# EAGLE schematic Self Designed Schematic (EAGLE 9.4.2)
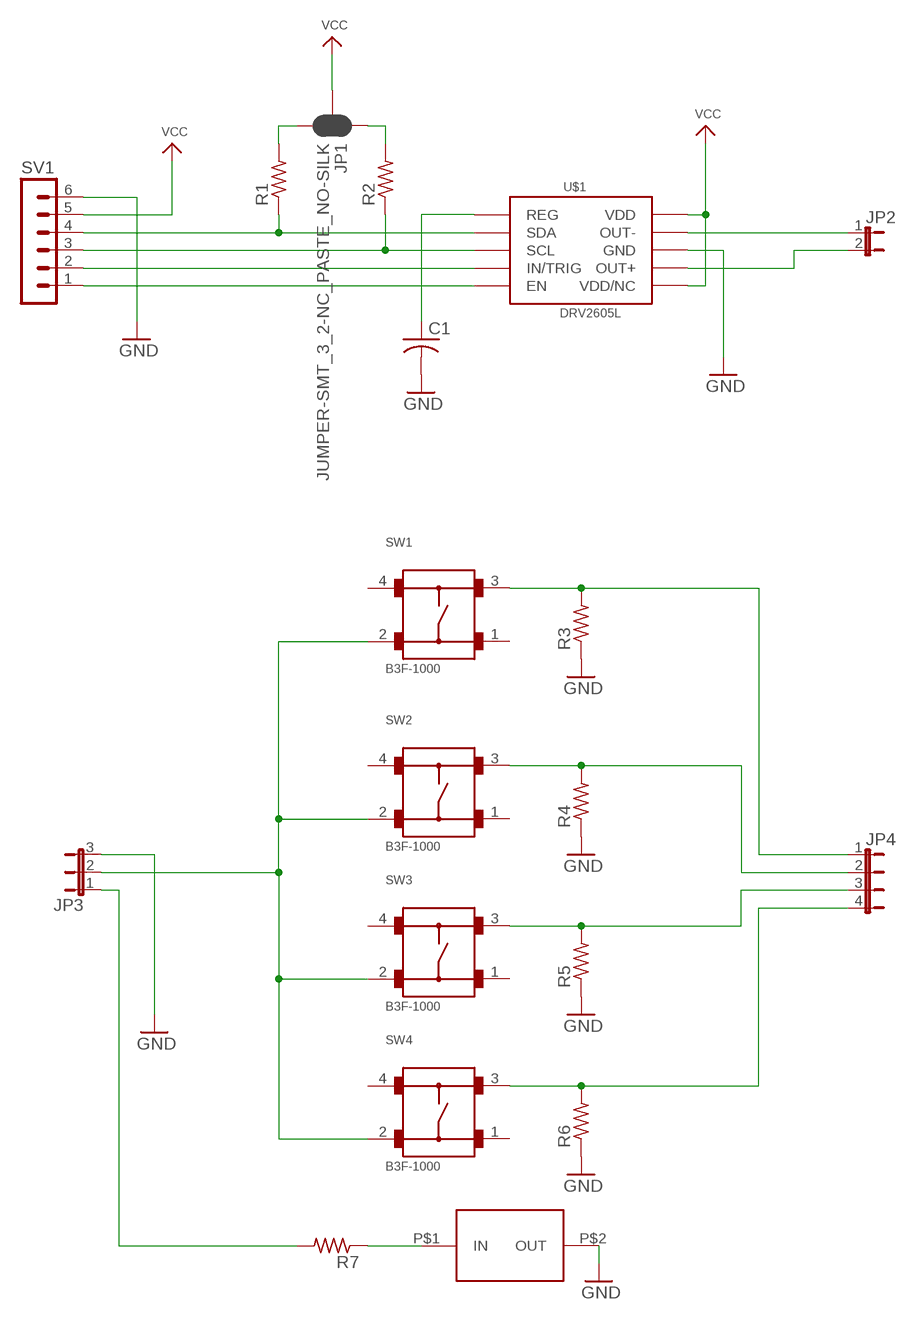
[diagram p0: schematic, sheet 1]

## Parts
C1  C-USC0402  [C0402]
JP1  JUMPER-SMT_3_2-NC_PASTE_NO-SILK  [SMT-JUMPER_3_2-NC_PASTE_NO-SILK]
JP2  JP1E  [JP1]
JP3  JP2W  [JP2W]
JP4  JP4E  [JP4]
R1  R-US_M0805  [M0805]
R2  R-US_M0805  [M0805]
R3  R-US_M0805  [M0805]
R4  R-US_M0805  [M0805]
R5  R-US_M0805  [M0805]
R6  R-US_M0805  [M0805]
R7  R-US_M0805  [M0805]
SV1  MA06-1  [MA06-1]
SW1  B3F-1000  [B3F-1000]
SW2  B3F-1000  [B3F-1000]
SW3  B3F-1000  [B3F-1000]
SW4  B3F-1000  [B3F-1000]
U$1  DRV2605L  [VSSOP-10]
U$2  PIEZOBUZZER  [PIEZOBUZZER]

## Nets
GND: C1.2 JP3.3 R3.1 R4.1 R5.1 R6.1 SV1.6 U$1.P$8(GND) U$2.P$2(OUT)
N$1: R1.1 SV1.4 U$1.P$3(SDA)
N$2: R2.1 SV1.3 U$1.P$2(SCL)
N$3: SV1.2 U$1.P$4(IN/TRIG)
N$4: SV1.1 U$1.P$5(EN)
N$5: C1.1 U$1.P$1(REG)
N$6: JP1.3 R1.2
N$7: JP1.1 R2.2
N$8: JP2.1 U$1.P$9(OUT-)
N$9: JP2.2 U$1.P$7(OUT+)
N$10: JP3.2 SW1.2 SW2.2 SW3.2 SW4.2
N$11: JP4.4 R6.2 SW4.3
N$12: JP4.3 R5.2 SW3.3
N$13: JP4.2 R4.2 SW2.3
N$14: JP4.1 R3.2 SW1.3
N$15: JP3.1 R7.2
N$16: R7.1 U$2.P$1(IN)
VCC: JP1.2 SV1.5 U$1.P$6(VDD/NC) U$1.P$10(VDD)
Unconnected: SW1.1 SW1.4 SW2.1 SW2.4 SW3.1 SW3.4 SW4.1 SW4.4

## Library data of the parts
C1 = adafruit:C-US: CAPACITOR, American symbol
JP1 = SparkFun-Jumpers:JUMPER-SMT_3_2-NC_PASTE: Normally closed solder jumper (2 of 2 connections) This jumper has an aperture in the stencil to allow solder paste to bridge both connections. Both connections are normally closed (NC). Wick off the solder to open the connection(s). Reapply solder to reclose the connection(s).
JP2 = jumper:JP1E: JUMPER
JP3 = jumper:JP2W: JUMPER
JP4 = jumper:JP4E: JUMPER
R1-R7 = BeagleBone_Black_Wireless:R-US_: RESISTOR, American symbol
SV1 = con-lstb:MA06-1: PIN HEADER; OC_FARNELL: unknown; OC_NEWARK: unknown
SW1-SW4 = Switch:B3F-1000: Tactile Switch SPST-NO Top Actuated Through Hole Manufacturer's datasheet <https://omronfs.omron.com/en_US/ecb/products/pdf/en-b3f.pdf>; CREATED_BY: PCBLayout.com; DIGI_KEY_PART_NUMBER: SW400-ND; MANUFACTURER: Omron Electronics Inc-EMC Div; MPN: B3F-1000; PACKAGE: SPST-NO
U$1 = SparkFun-IC-Special-Function:DRV2605L; PROD_ID: IC-13504
U$2 = piezobuzzerlayout:PIEZOBUZZER